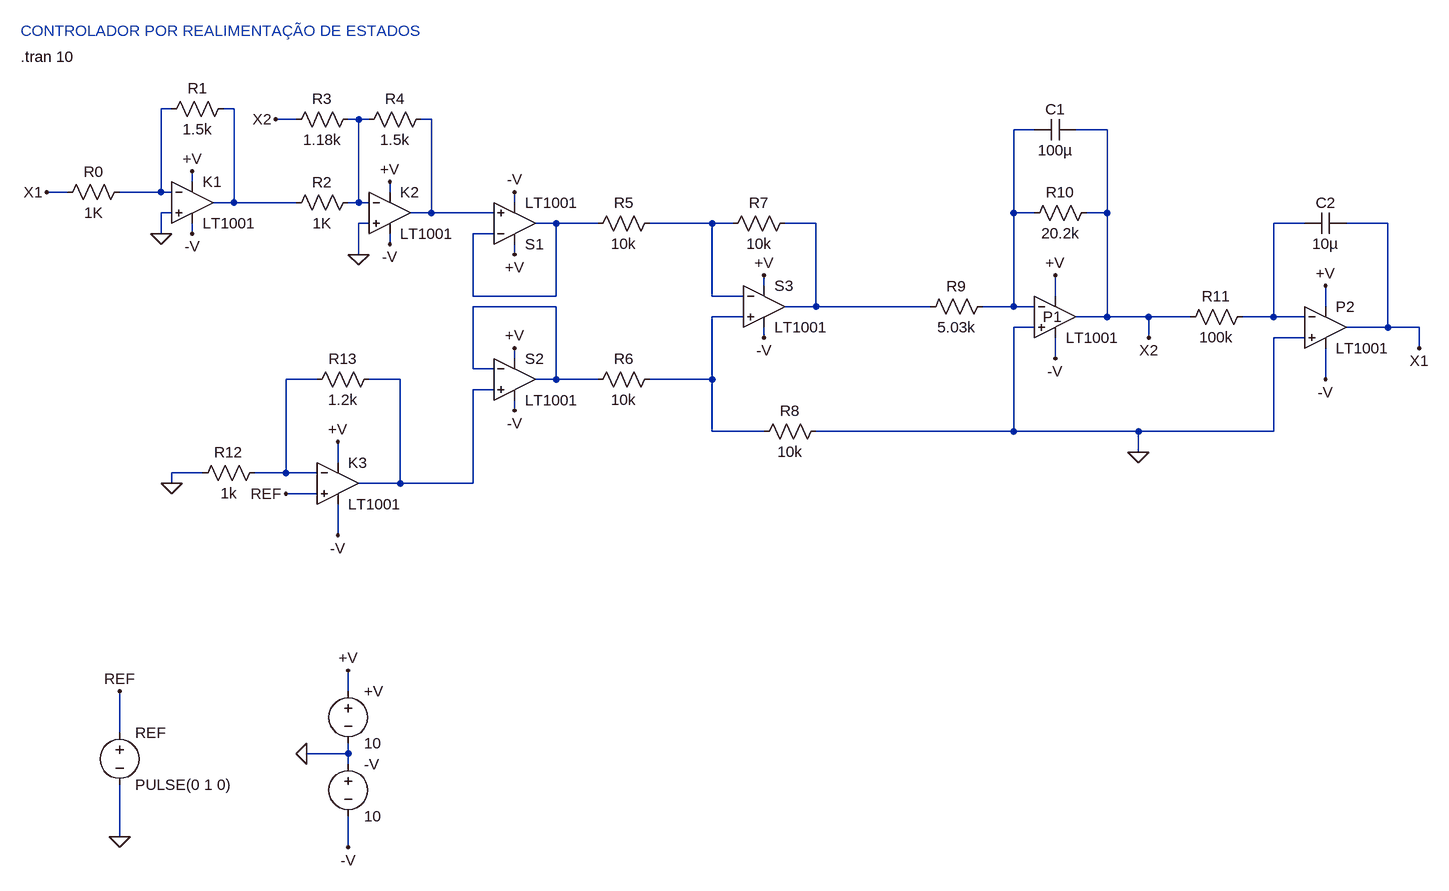
[diagram p0: schematic Plant_K_PD_otimizado.asc]
Plant_K_PD_otimizado.asc, the LTspice schematic file:
Version 4
SHEET 1 2304 1188
WIRE -112 -128 -128 -128
WIRE -16 -128 -32 -128
WIRE 80 -112 48 -112
WIRE 176 -112 160 -112
WIRE 192 -112 176 -112
WIRE 288 -112 272 -112
WIRE 1216 -96 1184 -96
WIRE 1328 -96 1280 -96
WIRE -80 -16 -80 -32
WIRE -272 0 -304 0
WIRE -128 0 -128 -128
WIRE -128 0 -192 0
WIRE -112 0 -128 0
WIRE 224 0 224 -16
WIRE -16 16 -16 -128
WIRE -16 16 -48 16
WIRE 80 16 -16 16
WIRE 176 16 176 -112
WIRE 176 16 160 16
WIRE 192 16 176 16
WIRE 416 16 416 0
WIRE -112 32 -128 32
WIRE 288 32 288 -112
WIRE 288 32 256 32
WIRE 384 32 288 32
WIRE 1184 32 1184 -96
WIRE 1216 32 1184 32
WIRE 1328 32 1328 -96
WIRE 1328 32 1296 32
WIRE 192 48 176 48
WIRE 480 48 448 48
WIRE 544 48 480 48
WIRE 720 48 624 48
WIRE 752 48 720 48
WIRE 880 48 832 48
WIRE 1632 48 1584 48
WIRE 1760 48 1696 48
WIRE -128 64 -128 32
WIRE -80 64 -80 48
WIRE 384 64 352 64
WIRE 224 80 224 64
WIRE 176 96 176 48
WIRE 416 96 416 80
WIRE 800 144 800 128
WIRE 352 160 352 64
WIRE 480 160 480 48
WIRE 480 160 352 160
WIRE 720 160 720 48
WIRE 768 160 720 160
WIRE 1248 160 1248 128
WIRE 480 176 352 176
WIRE 880 176 880 48
WIRE 880 176 832 176
WIRE 1056 176 880 176
WIRE 1184 176 1184 32
WIRE 1184 176 1136 176
WIRE 1216 176 1184 176
WIRE 1664 176 1664 144
WIRE 768 192 720 192
WIRE 1328 192 1328 32
WIRE 1328 192 1280 192
WIRE 1392 192 1328 192
WIRE 1456 192 1392 192
WIRE 1584 192 1584 48
WIRE 1584 192 1536 192
WIRE 1632 192 1584 192
WIRE 1216 208 1184 208
WIRE 1760 208 1760 48
WIRE 1760 208 1696 208
WIRE 1808 208 1760 208
WIRE 800 224 800 208
WIRE 1392 224 1392 192
WIRE 1632 224 1584 224
WIRE 1808 240 1808 208
WIRE 416 256 416 240
WIRE 1248 256 1248 224
WIRE 352 272 352 176
WIRE 384 272 352 272
WIRE 112 288 64 288
WIRE 240 288 192 288
WIRE 480 288 480 176
WIRE 480 288 448 288
WIRE 544 288 480 288
WIRE 720 288 720 192
WIRE 720 288 624 288
WIRE 1664 288 1664 240
WIRE 384 304 352 304
WIRE 416 336 416 320
WIRE 720 368 720 288
WIRE 800 368 720 368
WIRE 1184 368 1184 208
WIRE 1184 368 880 368
WIRE 1376 368 1184 368
WIRE 1584 368 1584 224
WIRE 1584 368 1376 368
WIRE 1376 400 1376 368
WIRE 144 416 144 384
WIRE -64 432 -112 432
WIRE 64 432 64 288
WIRE 64 432 16 432
WIRE 112 432 64 432
WIRE -112 448 -112 432
WIRE 240 448 240 288
WIRE 240 448 176 448
WIRE 352 448 352 304
WIRE 352 448 240 448
WIRE 112 464 64 464
WIRE 144 528 144 480
WIRE 160 768 160 736
WIRE -192 832 -192 768
WIRE 160 864 160 848
WIRE 160 864 96 864
WIRE 160 880 160 864
WIRE -192 992 -192 912
WIRE 160 1008 160 960
FLAG 416 0 -V
FLAG 800 128 +V
FLAG 416 240 +V
FLAG 416 96 +V
FLAG 800 224 -V
FLAG 416 336 -V
FLAG 160 736 +V
FLAG 160 1008 -V
FLAG 96 864 0
FLAG -192 992 0
FLAG -192 768 REF
FLAG 1664 144 +V
FLAG 1248 128 +V
FLAG 1664 288 -V
FLAG 1248 256 -V
FLAG 1376 400 0
FLAG -80 -32 +V
FLAG -80 64 -V
FLAG 1392 224 X2
FLAG 224 -16 +V
FLAG 224 80 -V
FLAG 48 -112 X2
FLAG -304 0 X1
FLAG 1808 240 X1
FLAG 144 384 +V
FLAG 144 528 -V
FLAG -112 448 0
FLAG 64 464 REF
FLAG 176 96 0
FLAG -128 64 0
SYMBOL Opamps\\LT1001 416 112 M180
SYMATTR InstName S1
SYMBOL Opamps\\LT1001 800 112 R0
SYMATTR InstName S3
SYMBOL Opamps\\LT1001 416 224 R0
SYMATTR InstName S2
SYMBOL res 640 32 R90
WINDOW 0 0 56 VBottom 2
WINDOW 3 32 56 VTop 2
SYMATTR InstName R5
SYMATTR Value 10k
SYMBOL res 640 272 R90
WINDOW 0 0 56 VBottom 2
WINDOW 3 32 56 VTop 2
SYMATTR InstName R6
SYMATTR Value 10k
SYMBOL res 848 32 R90
WINDOW 0 0 56 VBottom 2
WINDOW 3 32 56 VTop 2
SYMATTR InstName R7
SYMATTR Value 10k
SYMBOL res 896 352 R90
WINDOW 0 0 56 VBottom 2
WINDOW 3 32 56 VTop 2
SYMATTR InstName R8
SYMATTR Value 10k
SYMBOL voltage 160 752 R0
WINDOW 123 0 0 Left 2
WINDOW 39 0 0 Left 2
SYMATTR InstName +V
SYMATTR Value 10
SYMBOL voltage 160 864 R0
WINDOW 123 0 0 Left 2
WINDOW 39 0 0 Left 2
SYMATTR InstName -V
SYMATTR Value 10
SYMBOL voltage -192 816 R0
WINDOW 123 0 0 Left 2
WINDOW 39 0 0 Left 2
SYMATTR InstName REF
SYMATTR Value PULSE(0 1 0)
SYMBOL Opamps\\LT1001 1664 144 R0
SYMATTR InstName P2
SYMBOL Opamps\\LT1001 1248 128 R0
WINDOW 0 -19 64 Left 2
SYMATTR InstName P1
SYMBOL res 1552 176 R90
WINDOW 0 0 56 VBottom 2
WINDOW 3 32 56 VTop 2
SYMATTR InstName R11
SYMATTR Value 100k
SYMBOL res 1152 160 R90
WINDOW 0 0 56 VBottom 2
WINDOW 3 32 56 VTop 2
SYMATTR InstName R9
SYMATTR Value 5.03k
SYMBOL res 1312 16 R90
WINDOW 0 0 56 VBottom 2
WINDOW 3 32 56 VTop 2
SYMATTR InstName R10
SYMATTR Value 20.2k
SYMBOL cap 1280 -112 R90
WINDOW 0 0 32 VBottom 2
WINDOW 3 32 32 VTop 2
SYMATTR InstName C1
SYMATTR Value 100µ
SYMBOL Opamps\\LT1001 -80 -48 R0
SYMATTR InstName K1
SYMBOL res -16 -144 R90
WINDOW 0 0 56 VBottom 2
WINDOW 3 32 56 VTop 2
SYMATTR InstName R1
SYMATTR Value 1.5k
SYMBOL res -176 -16 R90
WINDOW 0 0 56 VBottom 2
WINDOW 3 32 56 VTop 2
SYMATTR InstName R0
SYMATTR Value 1K
SYMBOL Opamps\\LT1001 224 -32 R0
SYMATTR InstName K2
SYMBOL res 288 -128 R90
WINDOW 0 0 56 VBottom 2
WINDOW 3 32 56 VTop 2
SYMATTR InstName R4
SYMATTR Value 1.5k
SYMBOL res 176 -128 R90
WINDOW 0 0 56 VBottom 2
WINDOW 3 32 56 VTop 2
SYMATTR InstName R3
SYMATTR Value 1.18k
SYMBOL cap 1696 32 R90
WINDOW 0 0 32 VBottom 2
WINDOW 3 32 32 VTop 2
SYMATTR InstName C2
SYMATTR Value 10µ
SYMBOL Opamps\\LT1001 144 384 R0
SYMATTR InstName K3
SYMBOL res 32 416 R90
WINDOW 0 0 56 VBottom 2
WINDOW 3 32 56 VTop 2
SYMATTR InstName R12
SYMATTR Value 1k
SYMBOL res 208 272 R90
WINDOW 0 0 56 VBottom 2
WINDOW 3 32 56 VTop 2
SYMATTR InstName R13
SYMATTR Value 1.2k
SYMBOL res 176 0 R90
WINDOW 0 0 56 VBottom 2
WINDOW 3 32 56 VTop 2
SYMATTR InstName R2
SYMATTR Value 1K
TEXT -344 -248 Left 2 ;CONTROLADOR POR REALIMENTAÇÃO DE ESTADOS
TEXT -344 -208 Left 2 !.tran 10

The netlist it stands for:
* Plant_K_PD_otimizado.asc
XS1 N004 N006 +V -V N006 LT1001  ; pins In+ In- V+ V- OUT
XS3 N011 N007 +V -V N008 LT1001  ; pins In+ In- V+ V- OUT
XS2 N013 N010 +V -V N010 LT1001  ; pins In+ In- V+ V- OUT
R5 N007 N006 10k
R6 N011 N010 10k
R7 N008 N007 10k
R8 0 N011 10k
V§+V +V 0 10
V§-V 0 -V 10
V§REF REF 0 PULSE(0 1 0)
XP2 0 N009 +V -V X1 LT1001  ; pins In+ In- V+ V- OUT
XP1 0 N005 +V -V X2 LT1001  ; pins In+ In- V+ V- OUT
R11 N009 X2 100k
R9 N005 N008 5.03k
R10 X2 N005 20.2k
C1 X2 N005 100µ
XK1 0 N001 +V -V N002 LT1001  ; pins In+ In- V+ V- OUT
R1 N002 N001 1.5k
R0 N001 X1 1K
XK2 0 N003 +V -V N004 LT1001  ; pins In+ In- V+ V- OUT
R4 N004 N003 1.5k
R3 N003 X2 1.18k
C2 X1 N009 10µ
XK3 REF N012 +V -V N013 LT1001  ; pins In+ In- V+ V- OUT
R12 N012 0 1k
R13 N013 N012 1.2k
R2 N003 N002 1K
* CONTROLADOR POR REALIMENTAÇÃO DE ESTADOS
.tran 10
.lib LTC.lib
.backanno
.end